# EasyEDA schematic oLoRa-part-LoRa.json
TITLE: oLoRa-part-LoRa; REV: 1.0; Date: 2019-08-19; Sheet: 1/1; Drawn By: 김석현; Company: RMTEC
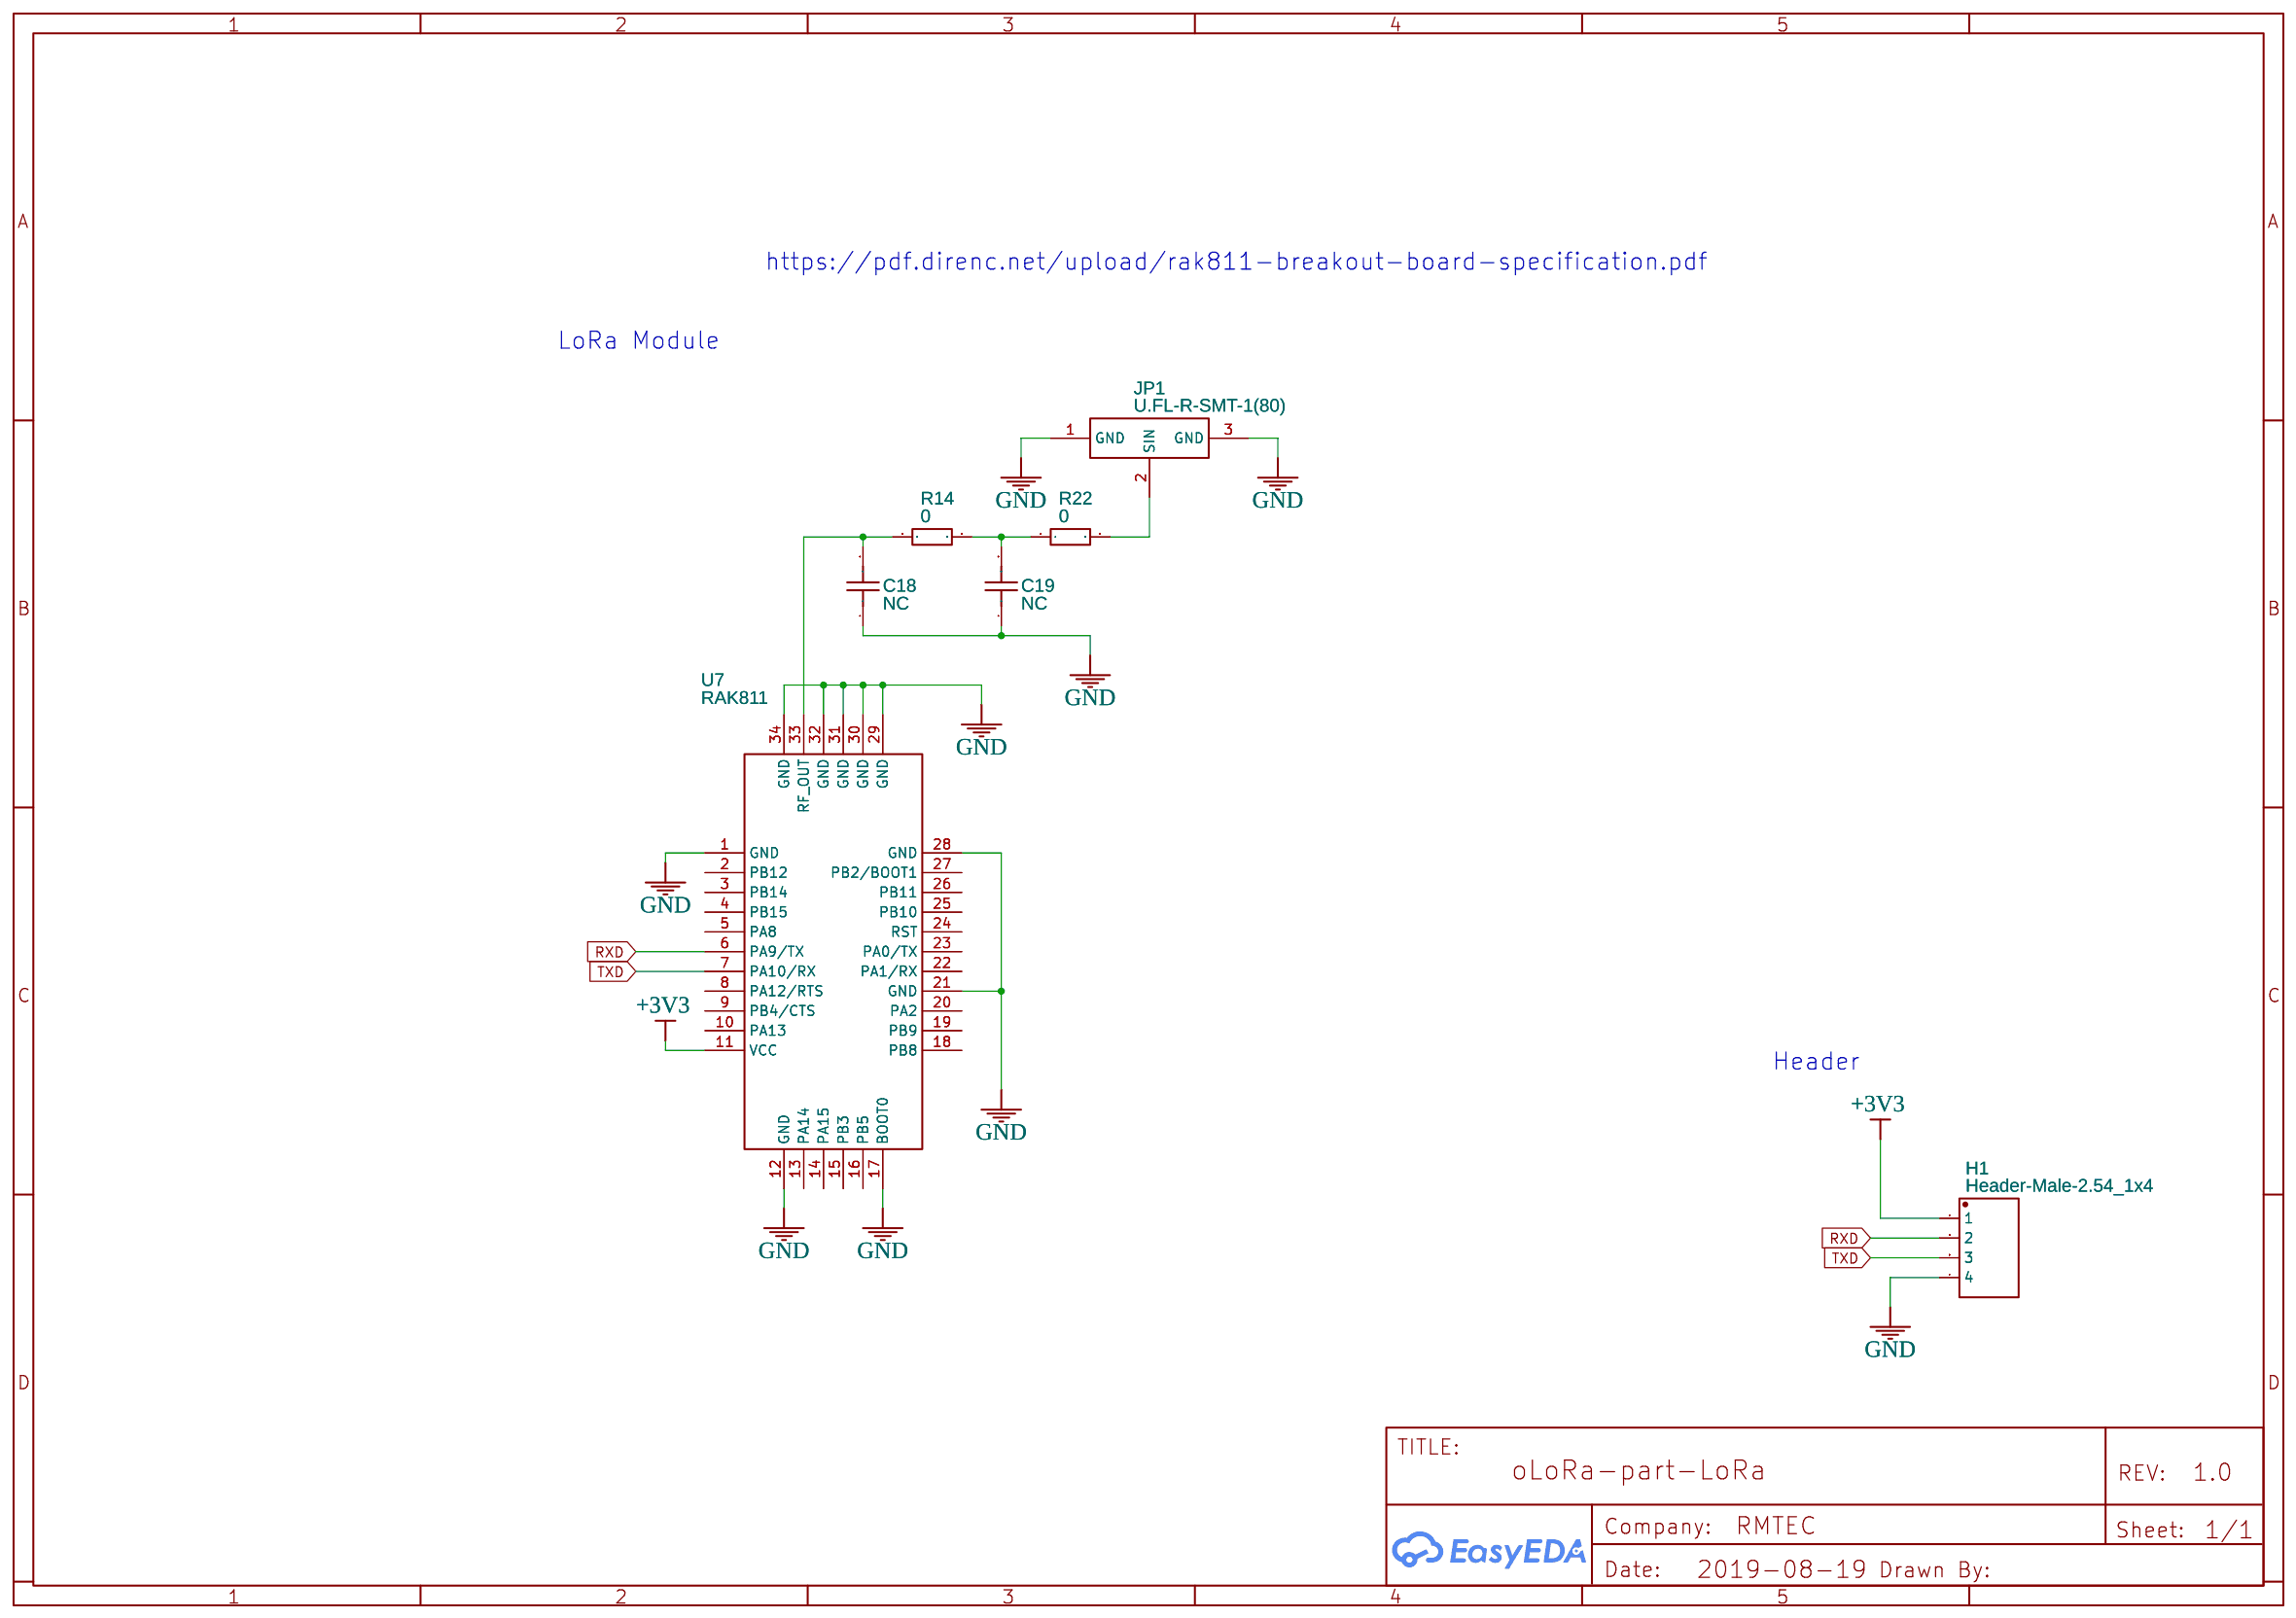
[diagram p0: schematic sheet]

## Parts
C18  NC  [0805]
C19  NC  [0805]
H1  Header-Male-2.54_1x4  [210S-1X4P]
JP1  U.FL-R-SMT-1(80)  [U.FL-R-SMT-1(80)]
R14  0  [0603]
R22  0  [0603]
U7  RAK811  [RAK811 LORA MODULE]

## Library data of the parts
C18 C19 = Cap_0805_US
H1 = -: Supplier: LCSC; Manufacturer: Ckmtw; Manufacturer Part: 210S-1*4P L=11.6MMGold-plated black; Contributor: LCSC; Supplier Part: C124378
JP1 = -: Supplier: LCSC; Manufacturer: HRS; Supplier Part: C88374
R14 R22 = 0603WAF0000T5E: Supplier: LCSC; Manufacturer: UniOhm; LCSC Assembly: Yes; Supplier Part: C21189; SMT Type: Basic
U7 = -: Contributor: spellbound; Supplier: RAK WIRELESS; link: http://www.rakwireless.com/en/module/lora/RAK811

## Nets
+3V3: H1.1 U7.11(VCC)
GND: C18.1 C19.1 H1.4 JP1.1(GND) JP1.3(GND) U7.1(GND) U7.12(GND) U7.17(BOOT0) U7.21(GND) U7.28(GND) U7.29(GND) U7.30(GND) U7.31(GND) U7.32(GND) U7.34(GND)
RXD: H1.2 U7.6(PA9/TX)
TXD: H1.3 U7.7(PA10/RX)
Net-(C18-2): C18.2 R14.1 U7.33(RF_OUT)
Net-(C19-2): C19.2 R14.2 R22.1
Net-(JP1-2): JP1.2(SIN) R22.2

Not connected (* = marked no-connect by the designer): U7 2(PB12) 3(PB14) 4(PB15) 5(PA8) 8(PA12/RTS) 9(PB4/CTS) 10(PA13) 13(PA14) 14(PA15) 15(PB3) 16(PB5) 18(PB8) 19(PB9) 20(PA2) 22(PA1/RX) 23(PA0/TX) 24(RST) 25(PB10) 26(PB11) 27(PB2/BOOT1)

## Notes on the sheet
- https://pdf.direnc.net/upload/rak811-breakout-board-specification.pdf
- LoRa Module
- Header
